# Altium schematic sheet Power.SchDoc
size A
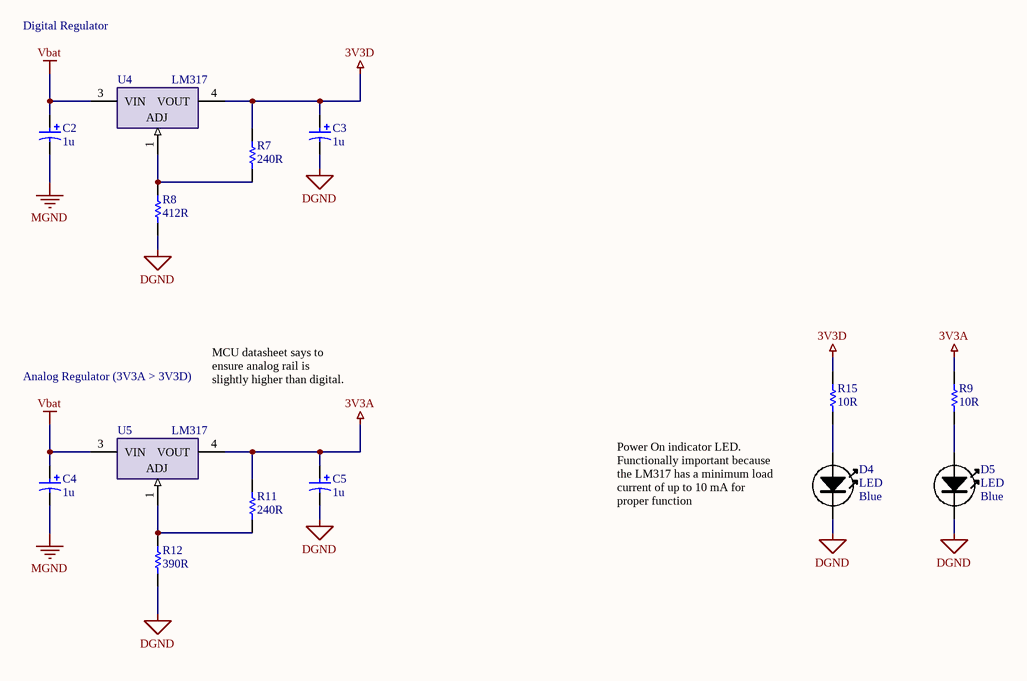
[diagram p0: Power.SchDoc]

## Parts
C2  value 1u  [C1206_tant_low_density]  (hidden comment: CapTant)
C3  value 1u  [C1206_tant_low_density]  (hidden comment: CapTant)
C4  value 1u  [C1206_tant_low_density]  (hidden comment: CapTant)
C5  value 1u  [C1206_tant_low_density]  (hidden comment: CapTant)
D4  LED  value Blue  [LED0805]
D5  LED  value Blue  [LED0805]
R7  value 240R  [R0805_med_density]  (hidden comment: ResChip)
R8  value 412R  [R0805_med_density]  (hidden comment: ResChip)
R9  value 10R  [R0805_med_density]  (hidden comment: ResChip)
R11  value 240R  [R0805_med_density]  (hidden comment: ResChip)
R12  value 390R  [R0805_med_density]  (hidden comment: ResChip)
R15  value 10R  [R0805_med_density]  (hidden comment: ResChip)
U4  LM317  [D-PAK]
U5  LM317  [D-PAK]

## Nets
3V3A: C5.1 R9.2 R11.2 U5.4(VOUT)
3V3D: C3.1 R7.2 R15.2 U4.4(VOUT)
DGND: C3.2 C5.2 D4.K D5.K R8.1 R12.1
MGND: C2.2 C4.2
Vbat: C2.1 C4.1 U4.3(VIN) U5.3(VIN)
NetD4_A: D4.A R15.1
NetD5_A: D5.A R9.1
NetR7_1: R7.1 R8.2 U4.1(ADJ)
NetR11_1: R11.1 R12.2 U5.1(ADJ)

## Notes on the sheet
- Digital Regulator
- Analog Regulator (3V3A > 3V3D)
- MCU datasheet says to ensure analog rail is slightly higher than digital.
- Power On indicator LED. Functionally important because the LM317 has a minimum load current of up to 10 mA for proper function

## Library data of the parts
C2-C5 = CapTant: Through-hole tantalum capacitor; Rating: 50V; Tolerance: *; Package: THD, 100mil pitch, 4.5mm diameter
D4 D5 = LED: Light-emitting diode; Package: *
R7 R8 R11 R12 = ResChip: SMD Chip resistor; Tolerance: 1%; Rating: *; Package: *
R9 R15 = ResChip: SMD Chip resistor; Tolerance: *; Rating: *; Package: *
U4 U5 = LM317: Linear Voltage Regulator